# Altium schematic sheet USB interface.SchDoc
size A4; SheetNumber: 3; SheetTotal: 7
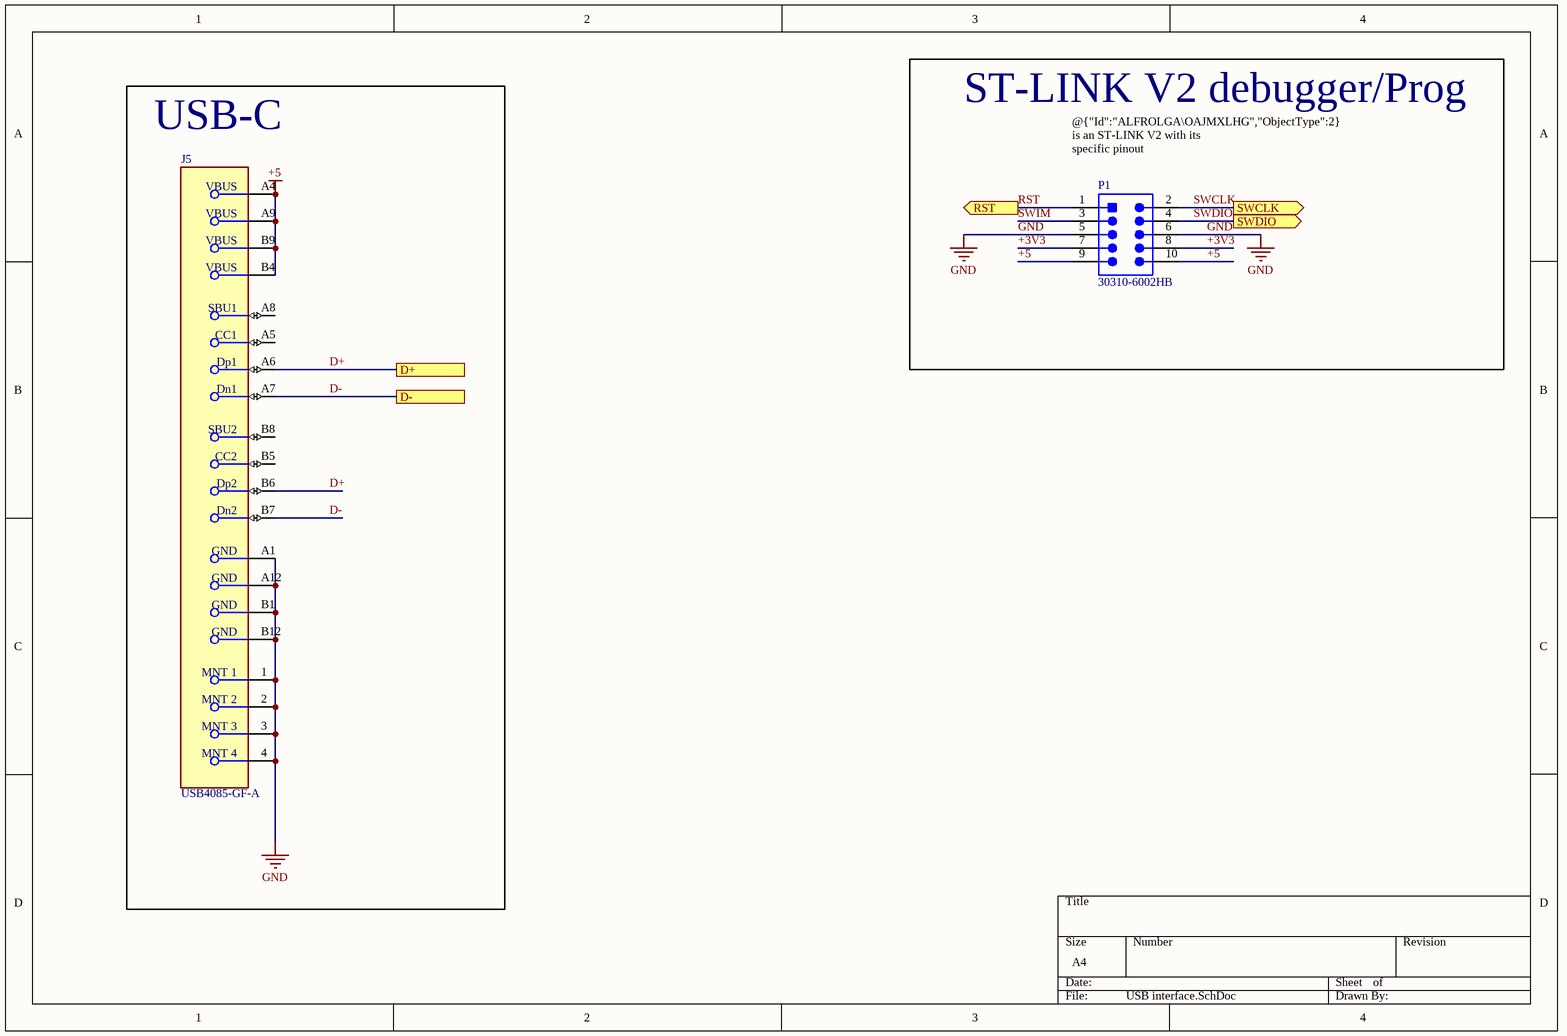
[diagram p0: USB interface.SchDoc]

## Parts
J5  USB4085-GF-A  [FP-USB4085-GF-A-MFG]
P1  30310-6002HB  [3M-30310-6002HB-10_V]

## Blocks framed on the sheet
USB-C: J5
ST-LINK V2 debugger/Prog: P1

## Ports
D+, D-, RST (out), SWCLK (out), SWDIO (out)

## Nets
+5: J5.A4(VBUS) J5.A9(VBUS) J5.B4(VBUS) J5.B9(VBUS) P1.9 P1.10
GND: J5.1(MNT_1) J5.2(MNT_2) J5.3(MNT_3) J5.4(MNT_4) J5.A1(GND) J5.A12(GND) J5.B1(GND) J5.B12(GND) P1.5 P1.6
+3V3: P1.7 P1.8
D+: J5.A6(Dp1) J5.B6(Dp2) ; port D+
D-: J5.A7(Dn1) J5.B7(Dn2) ; port D-
RST: P1.1 ; port RST
SWCLK: P1.2 ; port SWCLK
SWDIO: P1.4 ; port SWDIO
SWIM: P1.3

Not connected (* = marked no-connect by the designer): J5 A5(CC1) A8(SBU1) B5(CC2) B8(SBU2)

## Notes on the sheet
- (near P1) @{"Id":"ALFROLGA\OAJMXLHG","ObjectType":2} is an ST-LINK V2 with its specific pinout

## Library data of the parts
J5 = CMP-196119-000001-2: CONN RCPT USB2.0 TYPE C 24POS RA; Gender: Receptacle; Number of Positions: 16; USB Standard: USB 2.0; Orientation: Right Angle; Contact Plating: Gold; Contact Material: Copper Alloy
P1 = CMP-2000-05031-1: Male Header, Pitch 2.54 mm, 2 x 5 Position, Height 9.3 mm, Tail Length 2.79 mm, -55 to 105 degC, RoHS, Bulk; Manufacturer: 3M; Current Rating: 1A; Brand: 3MElectronicSolutionsDivision; Mounting Angle: Straight; Number of Positions: 10Position; Mating Post Length: 5.99mm; Pitch: 2.54mm; Manufacturer URL: http://www.3m.com/; Factory Pack Quantity: 1000; Mounting Style: StraightPin; Number of Rows: 2Row; Termination Post Length: 2.79mm; Contact Gender: Pin(Male); Contact Material: Brass; Termination Style: ThroughHole; Product: Headers; Packaging: Tray; Product Category: Headers&WireHousings; Type: Shrouded; Datasheet URL: http://datasheet.octopart.com/30310-6002HB-3M-datasheet-11537585.pdf; Datasheet Version: Apr-12; Contact Plating: Gold; Row Spacing: 2.54mm; Housing Material: Polyester; Series: 303; RoHS: Details